# Altium project LED Power Board.PrjPcb
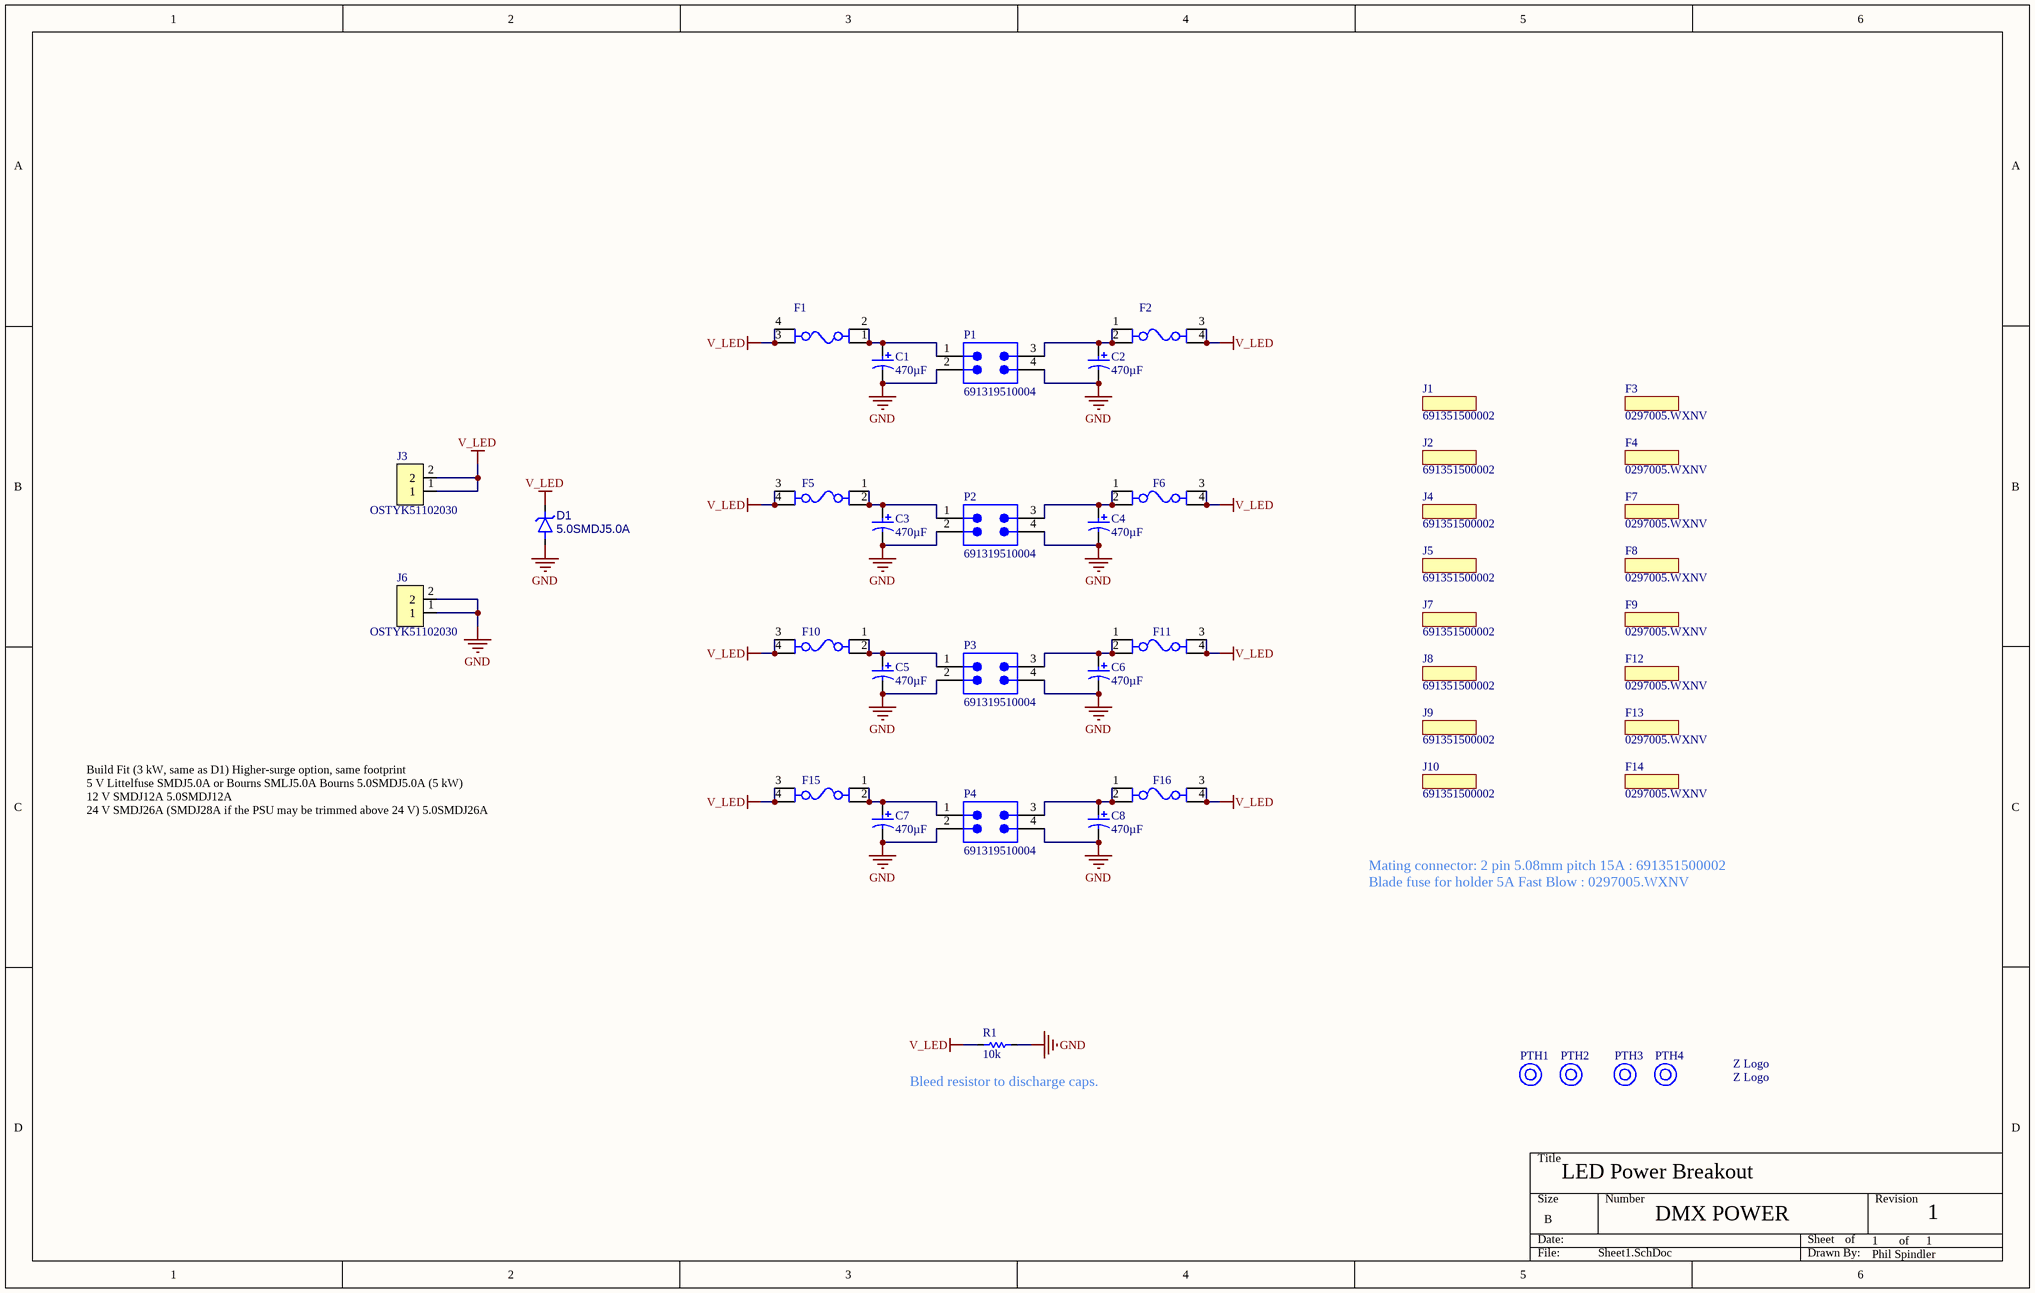
[diagram p0: Sheet1.SchDoc]
PROJECT_TITLE: DMX POWER; REV: 1
1 sheet, 45 parts. Net scope: global (net labels, ports and power ports of the same name join across sheets).
Board file: PCB1.PcbDoc

## Sheet Sheet1.SchDoc: LED Power Breakout
size B; DrawnBy: Phil Spindler; SheetNumber: 1; SheetTotal: 1

### Parts
_1  Z Logo  [Z Logo 0.5"]  (no BOM)
C1  value 470µF  [CAP_POL_DIAM10_H22_SPACING5]  (hidden comment: REH1020471M050K)
C2  value 470µF  [CAP_POL_DIAM10_H22_SPACING5]  (hidden comment: REH1020471M050K)
C3  value 470µF  [CAP_POL_DIAM10_H22_SPACING5]  (hidden comment: REH1020471M050K)
C4  value 470µF  [CAP_POL_DIAM10_H22_SPACING5]  (hidden comment: REH1020471M050K)
C5  value 470µF  [CAP_POL_DIAM10_H22_SPACING5]  (hidden comment: REH1020471M050K)
C6  value 470µF  [CAP_POL_DIAM10_H22_SPACING5]  (hidden comment: REH1020471M050K)
C7  value 470µF  [CAP_POL_DIAM10_H22_SPACING5]  (hidden comment: REH1020471M050K)
C8  value 470µF  [CAP_POL_DIAM10_H22_SPACING5]  (hidden comment: REH1020471M050K)
D1  5.0SMDJ5.0A  [SMDJ_DO-214AB]
F1  3544-2  [3544-2-Footprint-1]  (value not drawn)
F2  3544-2  [3544-2-Footprint-1]  (value not drawn)
F3  0297005.WXNV  [FP-0297-MFG]  (mechanical)
F4  0297005.WXNV  [FP-0297-MFG]  (mechanical)
F5  3544-2  [3544-2-Footprint-1]  (value not drawn)
F6  3544-2  [3544-2-Footprint-1]  (value not drawn)
F7  0297005.WXNV  [FP-0297-MFG]  (mechanical)
F8  0297005.WXNV  [FP-0297-MFG]  (mechanical)
F9  0297005.WXNV  [FP-0297-MFG]  (mechanical)
F10  3544-2  [3544-2-Footprint-1]  (value not drawn)
F11  3544-2  [3544-2-Footprint-1]  (value not drawn)
F12  0297005.WXNV  [FP-0297-MFG]  (mechanical)
F13  0297005.WXNV  [FP-0297-MFG]  (mechanical)
F14  0297005.WXNV  [FP-0297-MFG]  (mechanical)
F15  3544-2  [3544-2-Footprint-1]  (value not drawn)
F16  3544-2  [3544-2-Footprint-1]  (value not drawn)
J1  691351500002  [691351500002-Footprint-1]  (mechanical)
J2  691351500002  [691351500002-Footprint-1]  (mechanical)
J3  OSTYK51102030  [OSTYK51102030-Footprint-1]
J4  691351500002  [691351500002-Footprint-1]  (mechanical)
J5  691351500002  [691351500002-Footprint-1]  (mechanical)
J6  OSTYK51102030  [OSTYK51102030-Footprint-1]
J7  691351500002  [691351500002-Footprint-1]  (mechanical)
J8  691351500002  [691351500002-Footprint-1]  (mechanical)
J9  691351500002  [691351500002-Footprint-1]  (mechanical)
J10  691351500002  [691351500002-Footprint-1]  (mechanical)
P1  691319510004  [691319510004]
P2  691319510004  [691319510004]
P3  691319510004  [691319510004]
P4  691319510004  [691319510004]
PTH1  Mounting Hole NPTH  [Mounting Hole M3 No Washer NPTH]  (value not drawn)  (no BOM)
PTH2  Mounting Hole NPTH  [Mounting Hole M3 No Washer NPTH]  (value not drawn)  (no BOM)
PTH3  Mounting Hole NPTH  [Mounting Hole M3 No Washer NPTH]  (value not drawn)  (no BOM)
PTH4  Mounting Hole NPTH  [Mounting Hole M3 No Washer NPTH]  (value not drawn)  (no BOM)
R1  value 10k  [RESC3116X06N_1206MED]  (hidden comment: RC1206FR-0710KL)

### Nets
GND: C1.2 C2.2 C3.2 C4.2 C5.2 C6.2 C7.2 C8.2 D1.2(A) J6.1 J6.2 P1.2 P1.4 P2.2 P2.4 P3.2 P3.4 P4.2 P4.4 R1.2
V_LED: D1.1(K) F1.3 F1.4 F2.3 F2.4 F5.3 F5.4 F6.3 F6.4 F10.3 F10.4 F11.3 F11.4 F15.3 F15.4 F16.3 F16.4 J3.1 J3.2 R1.1
NetC1_1: C1.1 F1.1 F1.2 P1.1
NetC2_1: C2.1 F2.1 F2.2 P1.3
NetC3_1: C3.1 F5.1 F5.2 P2.1
NetC4_1: C4.1 F6.1 F6.2 P2.3
NetC5_1: C5.1 F10.1 F10.2 P3.1
NetC6_1: C6.1 F11.1 F11.2 P3.3
NetC7_1: C7.1 F15.1 F15.2 P4.1
NetC8_1: C8.1 F16.1 F16.2 P4.3

### Notes on the sheet
- Build	Fit (3 kW, same as D1)	Higher-surge option, same footprint
  5 V	Littelfuse SMDJ5.0A or Bourns SMLJ5.0A	Bourns 5.0SMDJ5.0A (5 kW)
  12 V	SMDJ12A	5.0SMDJ12A
  24 V	SMDJ26A (SMDJ28A if the PSU may be trimmed above 24 V)	5.0SMDJ26A
- Mating connector: 2 pin 5.08mm pitch 15A : 691351500002
  Blade fuse for holder 5A Fast Blow : 0297005.WXNV
- (near R1) Bleed resistor to discharge caps.
- of
- Cage Code
- Important: This print and its subject matter is the property of Equus Compute Solutions ("ECS") and is to be held in strict confidence. It may contain proprietary information, trade secrets, and/or other intellectual property which are owned by ECS. It may only be used for the submitted purpose. This print is not to be forwarded to other parties nor reprinted in any form without ECS's permission.
- Project Name
- Engineer
- Checker
- Date
- Sheet Title
- Doc. No.
- Rev
- File
- Size
- B
- Sheet

### Library data of the parts
_1 = CMP-00028-00046-1: Z logo silkscreen
C1-C8 = CMP-001-00166-2: CAP ALUM 470UF 20% 50V RADIAL TH; Capacitor Type: Aluminium; RoHS Compliant: Yes; Case/Package: Radial; Tolerance: 20%; Voltage Rating: 50V; Min Operating Temperature: 125°C; Max Operating Temperature: -40°C; Mounting Technology: Through Hole; Pins: 2
D1 = CMP-004-00056-1: 5V Unidirectional 5kW TVS Diode, 9.2V Vwm, 6.4V Vbr, SMC(DO-214AB), SMD; Max Surge Current: 326.1A; Mounting Technology: Surface Mount; Pins: 2; Min Operating Temperature: -55°C; Forward Voltage: 5V; Max Operating Temperature: 150°C
F1 F2 F5 F6 F10 F11 F15 F16 = CMP-005-00025-1: Auto blade fuse holder; for 2.8x0.8mm mini blade fuses ATM; 20A; THT; Current Rating: 30A; Max Operating Temperature: 145°C; Mounting Technology: PCB, Through Hole, Vertical; Min Operating Temperature: -50°C
F3 F4 F7-F9 F12-F14 = CMP-005-00024-3: Fuse Blade 5A 32V Socket 10.9 X 3.8 X 8.8mm Polyamide 66 Automotive UL; Min Operating Temperature: -40°C; Pins: 2; Max Operating Temperature: 125°C; Current Rating: 5A; Mounting Technology: Holder, Socket
J1 J2 J4 J5 J7-J10 = CMP-002-00248-4: Terminal Block, Pluggable, 2Pos, 12Awg;; Gender: Female; Voltage Rating: 300V; Pins: 2; Min Operating Temperature: -40°C; Max Operating Temperature: 105°C; Mounting Technology: Cable
J3 J6 = CMP-002-00246-1: Conn Terminal Block 2 POS 9.5mm Solder ST Thru-Hole 30A; Max Current Rating: 20A; Voltage Rating: 300V; Max Operating Temperature: 115°C; Pins: 2; Min Operating Temperature: -40°C; Mounting Technology: Screw
P1-P4 = CMP-002-00244-2: Terminal Block, 5.08MM, Dbl Lvl Horizontal Male Pcb Header W/closed Flange, 4PI; Max Current Rating: 10A; Min Operating Temperature: -40°C; Max Operating Temperature: 105°C; Pins: 4
PTH1-PTH4 = CMP-00028-00043-4
R1 = CMP-009-00344-1: Fixed Resistor, Metal Glaze/thick Film, 0.25W, 20000ohm, 200V, 1% +/-Tol, 100ppm/Cel, Surface Mount, 1206; Power: 250mW; RoHS Compliant: Yes; Voltage Rating: 200V; Pins: 2; Max Operating Temperature: 155°C; Case/Package: 1206; Mounting Technology: Surface Mount; Tolerance: 1%; Min Operating Temperature: -55°C

## Assembly variants
Production: all parts fitted